# EAGLE design PetitCool_PowerShield (EAGLE 7.3.0)
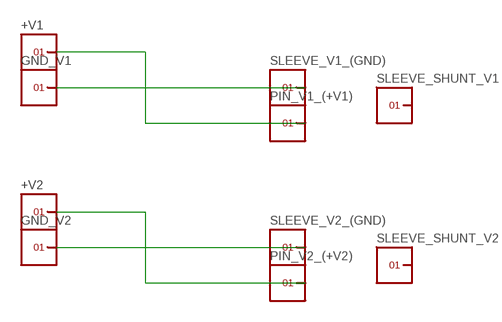
[diagram p0: schematic, sheet 1]

## Parts
+V1  1X1  [1X1]
+V2  1X1  [1X1]
GND_V1  1X1  [1X1]
GND_V2  1X1  [1X1]
PIN_V1_(+V1)  1X1  [1X1]
PIN_V2_(+V2)  1X1  [1X1]
SLEEVE_SHUNT_V1  1X1  [1X1]
SLEEVE_SHUNT_V2  1X1  [1X1]
SLEEVE_V1_(GND)  1X1  [1X1]
SLEEVE_V2_(GND)  1X1  [1X1]

## Nets
+V1: +V1.1 PIN_V1_(+V1).1
+V2: +V2.1 PIN_V2_(+V2).1
GND_V1: GND_V1.1 SLEEVE_V1_(GND).1
GND_V2: GND_V2.1 SLEEVE_V2_(GND).1
Unconnected: SLEEVE_SHUNT_V1.1 SLEEVE_SHUNT_V2.1

## Library data of the parts
+V1 +V2 GND_V1 GND_V2 PIN_V1_(+V1) PIN_V2_(+V2) SLEEVE_SHUNT_V1 SLEEVE_SHUNT_V2 SLEEVE_V1_(GND) SLEEVE_V2_(GND) = headers(.1in):1X1

## Board
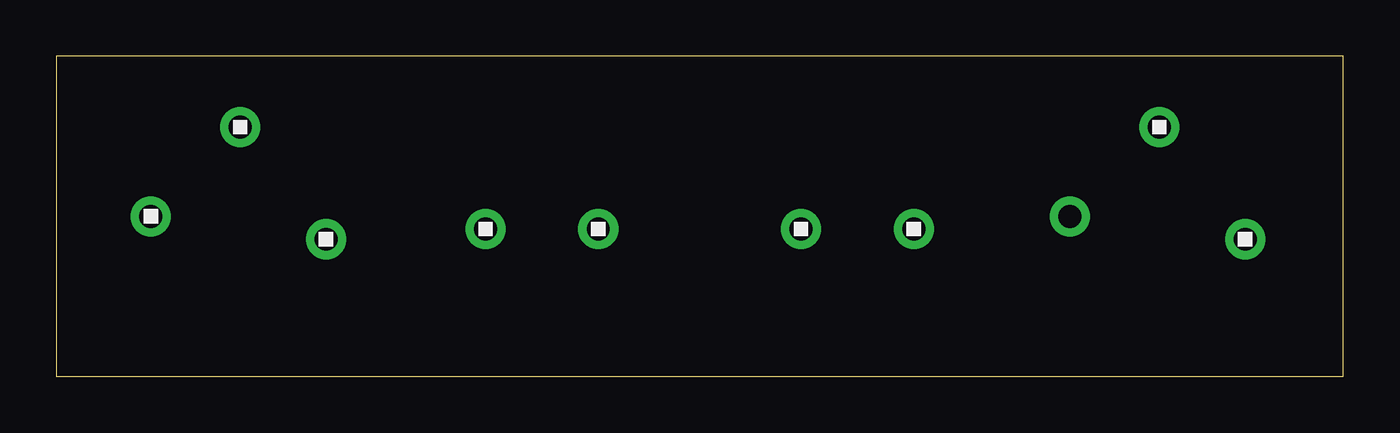
[diagram p1: board, top side]
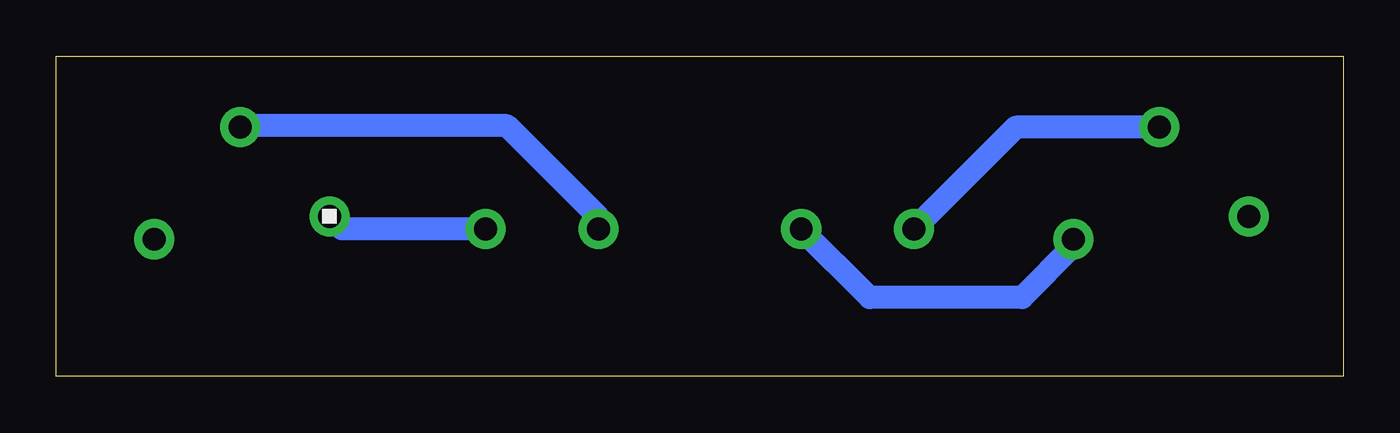
[diagram p2: board, bottom side, seen from below]

Size 57.1 x 14.22 mm. Coordinates in mm from the lower left corner, seen from the top.
Outline: 57.1,14.22 0,14.22 0,0 57.1,0 57.1,14.22
Copper layers (1*16): Top 0.035mm / dielectric 1.5mm / Bottom 0.035mm
Design rules "default": minimum track width 10mil, minimum drill 24mil, track to track 8mil, track to pad 8mil, pad to pad 8mil, via to via 8mil, smd to smd 8mil, copper to edge 40mil, drill to drill 8mil, minimum pad ring 10mil, minimum via ring 8mil, stop-mask expansion 4mil, vias tented up to drill 0mil, thermal gap 10mil

### Footprints (pad centres in the part's own frame; a part is rotated, then mirrored left to right if it is on the bottom)
1X1 = drill 1.016 pad 1.778: 1 0,0

### Placement (x,y rotation side)
+V1  24.05,6.55 0 top
+V2  38.04,6.55 0 top
GND_V1  19.05,6.55 0 top
GND_V2  33.04,6.55 0 top
PIN_V1_(+V1)  11.96,6.09 0 top
PIN_V2_(+V2)  44.98,7.11 0 bottom
SLEEVE_SHUNT_V1  4.19,7.11 0 top
SLEEVE_SHUNT_V2  52.75,6.09 0 top
SLEEVE_V1_(GND)  8.16,11.07 0 top
SLEEVE_V2_(GND)  48.94,11.07 0 top

### Tracks (layer width: path | path; a pad name or v marks a point on that pad's centre or on a via)
+V1
  Bottom 1.016: PIN_V1_(+V1).1 11.97,5.78 14.24,3.51 21.01,3.51 +V1.1
+V2
  Bottom 1.016: +V2.1 44.42,6.55 PIN_V2_(+V2).1
GND_V1
  Bottom 1.016: SLEEVE_V1_(GND).1 14.53,11.07 GND_V1.1
GND_V2
  Bottom 1.016: GND_V2.1 33.04,7.07 37.1,11.13 48.89,11.13 SLEEVE_V2_(GND).1